# EAGLE schematic H17R10 (EAGLE 9.6.2)

## Sheet 1 of 4: backend (logics)
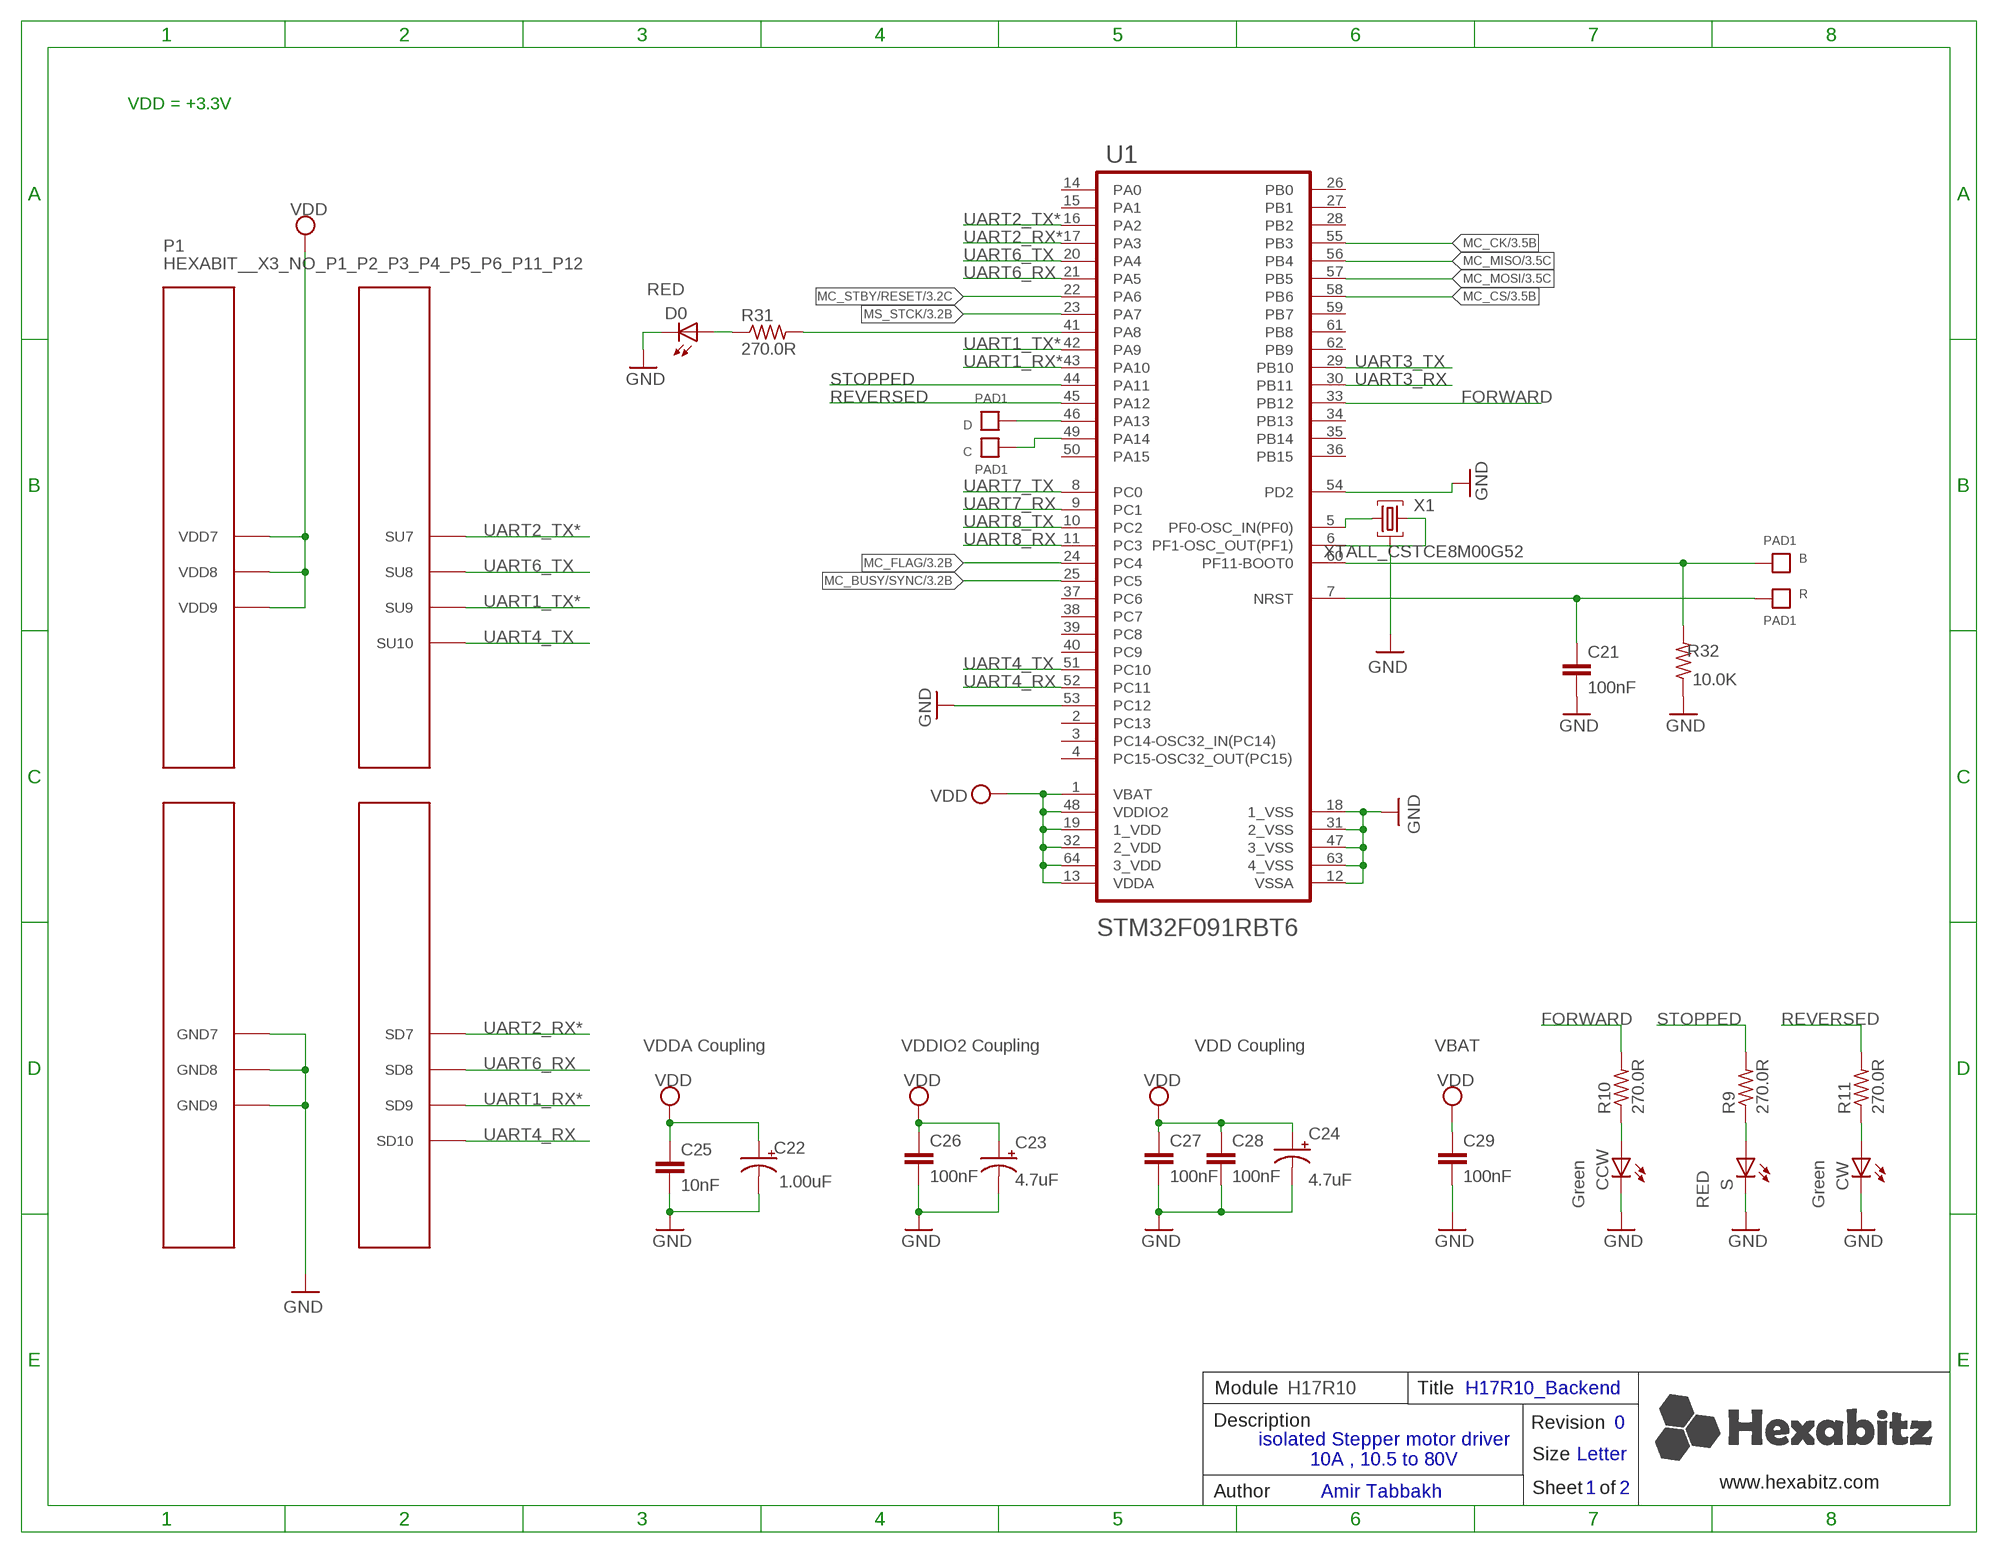
[diagram p0: schematic, sheet 1]

### Parts
B  PAD1  [PAD1]
C  PAD1  [PAD1]
C21  100nF  C-0603  [C-0603]
C22  1.00uF  C-0805-POL  [C-0805-POL]
C23  4.7uF  C-0805-POL  [C-0805-POL]
C24  4.7uF  C-0805-POL  [C-0805-POL]
C25  10nF  C-0603  [C-0603]
C26  100nF  C-0603  [C-0603]
C27  100nF  C-0603  [C-0603]
C28  100nF  C-0603  [C-0603]
C29  100nF  C-0603  [C-0603]
CCW  Green  VLMTG1300-GS08  [VLMTG1300-GS08]
CW  Green  VLMTG1300-GS08  [VLMTG1300-GS08]
D  PAD1  [PAD1]
D0  RED  VLMS1300-GS08  [VLMS1300-GS08]
P1  HEXABIT__X3_NO_P1_P2_P3_P4_P5_P6_P11_P12  [HEXABIT_17.32_X3_NO_P1_P2_P3_P4_P5_P6_P11_P12]
R  PAD1  [PAD1]
R9  270.0R  R-0603  [R-0603]
R10  270.0R  R-0603  [R-0603]
R11  270.0R  R-0603  [R-0603]
R31  270.0R  R-0603  [R-0603]
R32  10.0K  R-0603  [R-0603]
S  RED  VLMS1300-GS08  [VLMS1300-GS08]
U1  STM32F091RBT6STMICROELECTRONICS_STM32F091RBT6_0_1  [STMICROELECTRONICS_STM32F091RBT6_1]
X1  XTALL_CSTCE8M00G52  [XTALL_CSTCE8M00G52]

### Nets
B1: B.P$1 B.P$2 R32.2 U1.60(PF11-BOOT0)
FORWARD: R10.2 U1.33(PB12)
GND: C21.2 C22.2(-) C23.2(-) C24.2(-) C25.2 C26.2 C27.2 C28.2 C29.2 CCW.C CW.C D0.C P1.PAD_PD12(GND7) P1.PAD_PD17(GND8) P1.PAD_PD19(GND9) R32.1 S.C U1.12(VSSA) U1.18(1_VSS) U1.31(2_VSS) U1.47(3_VSS) U1.53(PC12) U1.54(PD2) U1.63(4_VSS) X1.P$2 ; also sheet 3,4
MC_BUSY/SYNC: U1.25(PC5) ; also sheet 3
MC_CK: U1.55(PB3) ; also sheet 3
MC_CS: U1.58(PB6) ; also sheet 3
MC_FLAG: U1.24(PC4) ; also sheet 3
MC_MISO: U1.56(PB4) ; also sheet 3
MC_MOSI: U1.57(PB5) ; also sheet 3
MC_STBY/RESET: U1.22(PA6) ; also sheet 3
MS_STCK: U1.23(PA7) ; also sheet 3
N$3: R31.2 U1.41(PA8)
N$4: D0.A R31.1
N$5: U1.5(PF0-OSC_IN(PF0)) X1.P$1
N$6: U1.6(PF1-OSC_OUT(PF1)) X1.P$3
N$7: D.P$1 D.P$2 U1.46(PA13)
N$9: C.P$1 C.P$2 U1.49(PA14)
N$11: R9.1 S.A
N$24: CCW.A R10.1
N$25: CW.A R11.1
R1: C21.1 R.P$1 R.P$2 U1.7(NRST)
REVERSED: R11.2 U1.45(PA12)
STOPPED: R9.2 U1.44(PA11)
UART1_RX*: P1.PAD_PD2(SD9) U1.43(PA10)
UART1_TX*: P1.PAD_PU2(SU9) U1.42(PA9)
UART2_RX*: P1.PAD_PD3(SD7) U1.17(PA3)
UART2_TX*: P1.PAD_PU3(SU7) U1.16(PA2)
UART3_RX: U1.30(PB11)
UART3_TX: U1.29(PB10)
UART4_RX: P1.PAD_PD8(SD10) U1.52(PC11)
UART4_TX: P1.PAD_PU8(SU10) U1.51(PC10)
UART6_RX: P1.PAD_PD1(SD8) U1.21(PA5)
UART6_TX: P1.PAD_PU1(SU8) U1.20(PA4)
UART7_RX: U1.9(PC1)
UART7_TX: U1.8(PC0)
UART8_RX: U1.11(PC3)
UART8_TX: U1.10(PC2)
VDD: C22.1(+) C23.1(+) C24.1(+) C25.1 C26.1 C27.1 C28.1 C29.1 P1.PAD_PU12(VDD7) P1.PAD_PU17(VDD8) P1.PAD_PU19(VDD9) U1.1(VBAT) U1.13(VDDA) U1.19(1_VDD) U1.32(2_VDD) U1.48(VDDIO2) U1.64(3_VDD) ; also sheet 3,4
Unconnected: U1.2(PC13) U1.3(PC14-OSC32_IN(PC14)) U1.4(PC15-OSC32_OUT(PC15)) U1.14(PA0) U1.15(PA1) U1.26(PB0) U1.27(PB1) U1.28(PB2) U1.34(PB13) U1.35(PB14) U1.36(PB15) U1.37(PC6) U1.38(PC7) U1.39(PC8) U1.40(PC9) U1.50(PA15) U1.59(PB7) U1.61(PB8) U1.62(PB9)

### Notes on the sheet
- VDD = +3.3V
- VDDA Coupling | VDDIO2 Coupling | VDD Coupling | VBAT
- Module | H17R10 | Title | H17R10_Backend
- Description | Revision | 0
- isolated Stepper motor driver 
  10A , 10.5 to 80V
- Size | Letter
- www.hexabitz.com
- Author | Amir Tabbakh | Sheet   of | 1 | 2
- C:/Users/Admin/Desktop/logodraft.bmp

## Sheet 2 of 4: High power
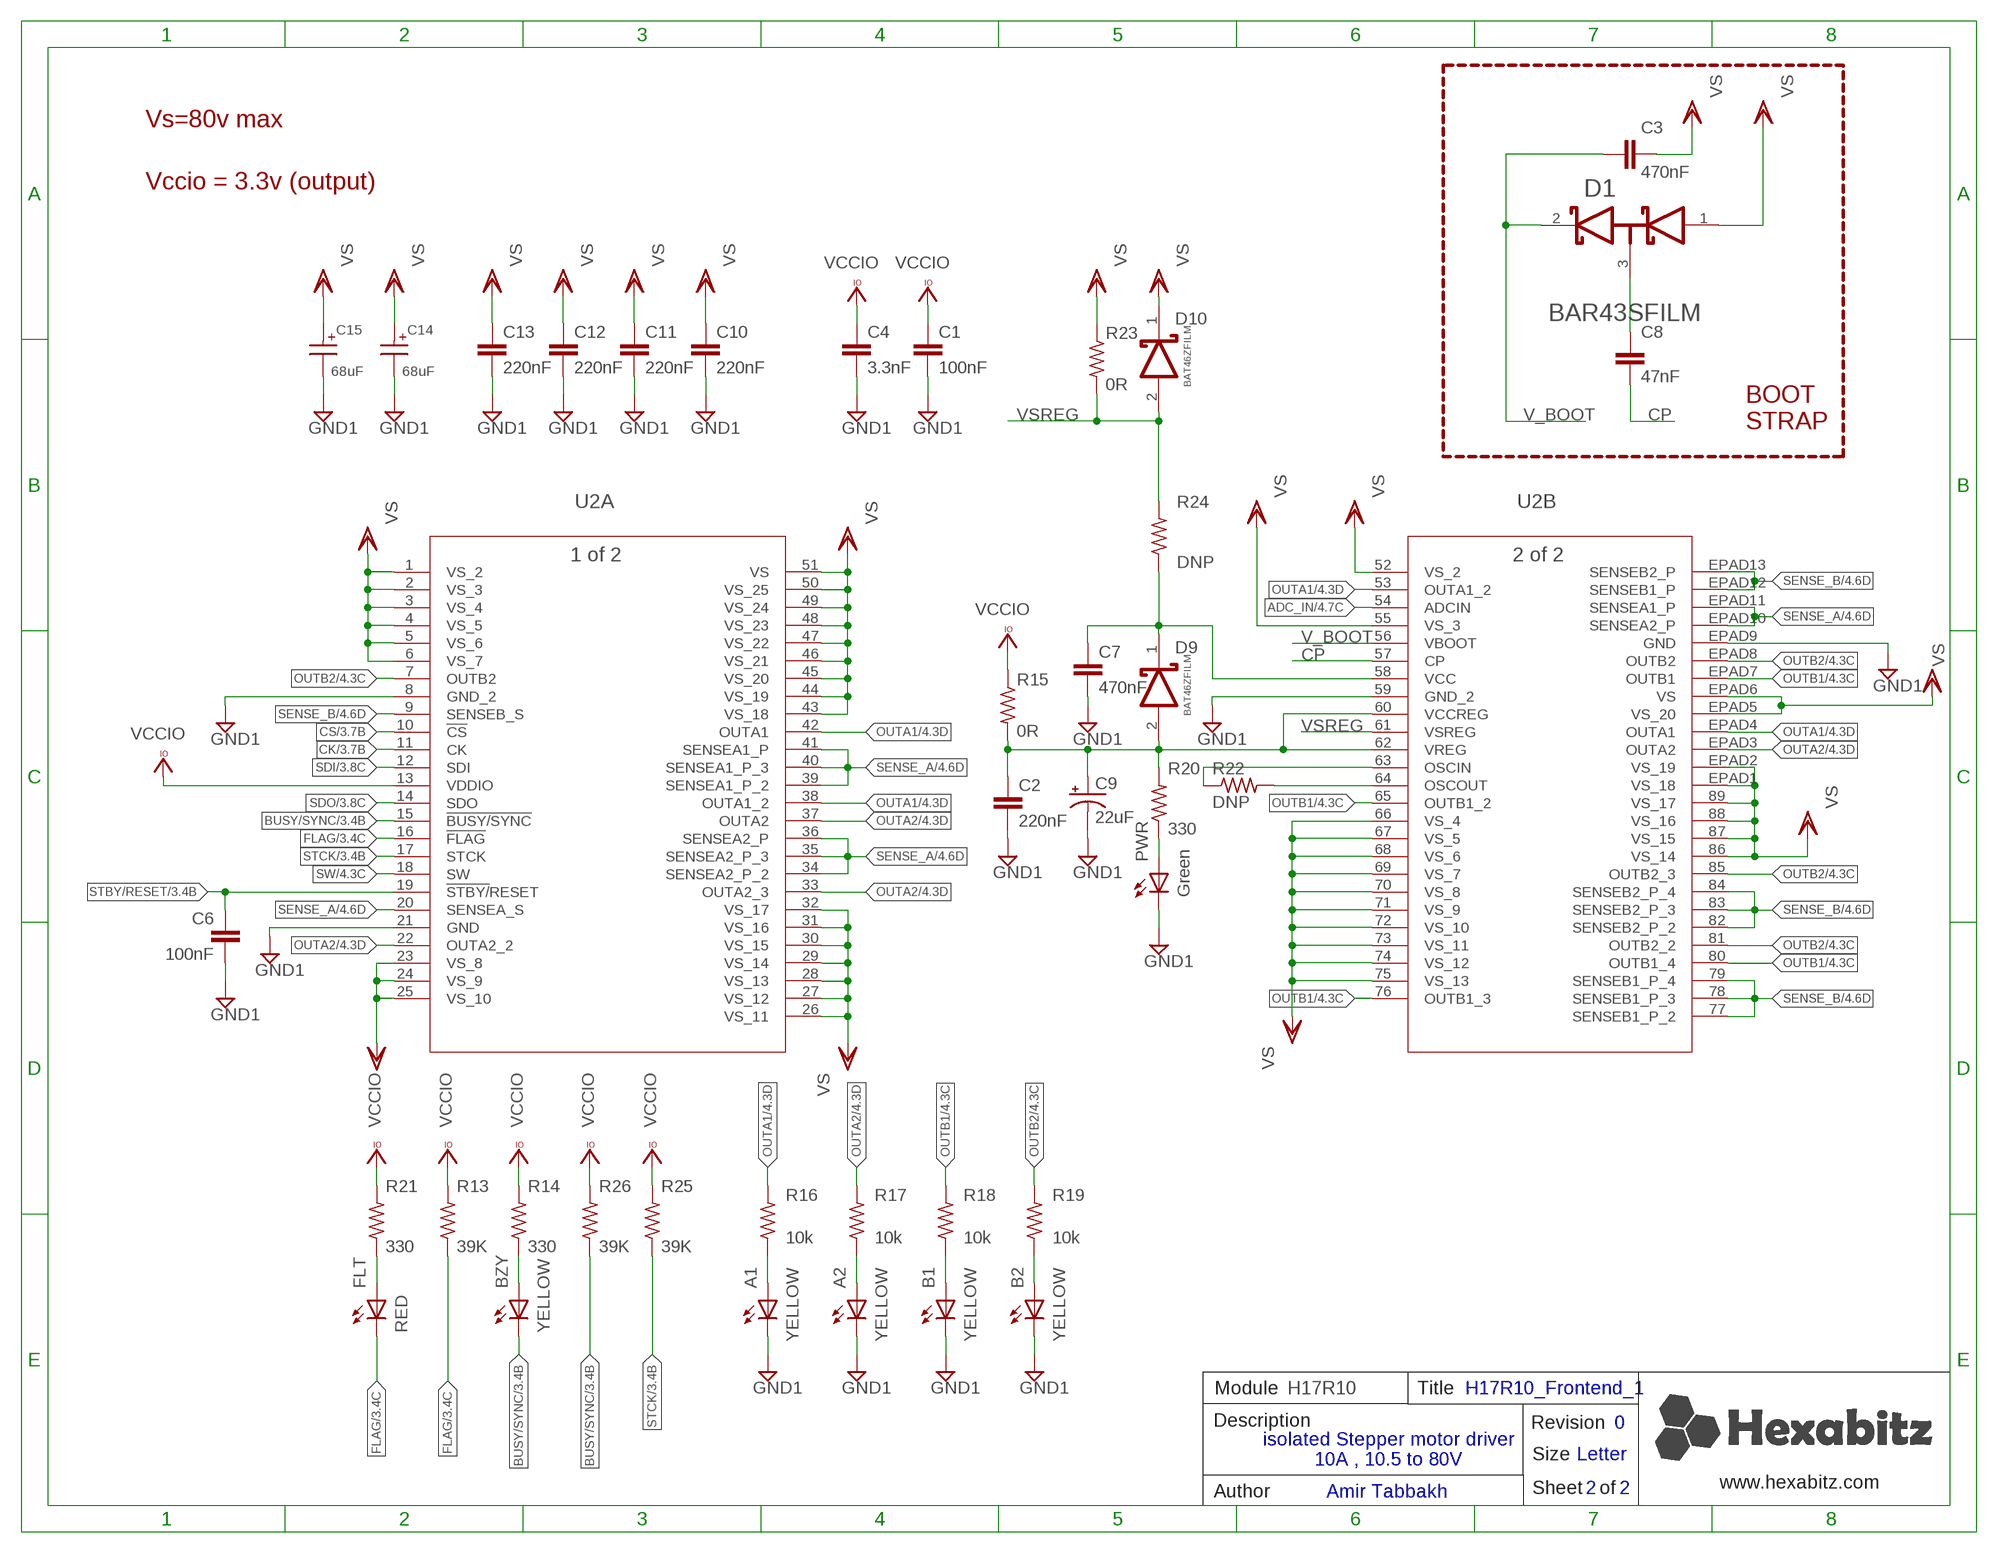
[diagram p1: schematic, sheet 2]

### Parts
A1  YELLOW  VLMY1300-GS08  [VLMY1300-GS08]
A2  YELLOW  VLMY1300-GS08  [VLMY1300-GS08]
B1  YELLOW  VLMY1300-GS08  [VLMY1300-GS08]
B2  YELLOW  VLMY1300-GS08  [VLMY1300-GS08]
BZY  YELLOW  VLMY1300-GS08  [VLMY1300-GS08]
C1  100nF  C-0603  [C-0603]
C2  220nF  C-0603  [C-0603]
C3  470nF  C-0603  [C-0603]
C4  3.3nF  C-0603  [C-0603]
C6  100nF  C-0603  [C-0603]
C7  470nF  C-0603  [C-0603]
C8  47nF  C-0805  [C-0805]
C9  22uF  C-0805-POL  [C-0805-POL]
C10  220nF  C-0805  [C-0805]
C11  220nF  C-0805  [C-0805]
C12  220nF  C-0805  [C-0805]
C13  220nF  C-0805  [C-0805]
C14  68uF  WCAP-ASLI_12.5X14EEVFK2A680Q  [WCAP-ASLI_12.5X14(DXL)]
C15  68uF  WCAP-ASLI_12.5X14EEVFK2A680Q  [WCAP-ASLI_12.5X14(DXL)]
D1  STMICROELECTRONICS_BAR43SFILMSTMICROELECTRONICS_BAR43SFILM_0_0  [STMICROELECTRONICS_BAR43SFILM_0]
D9  STMICROELECTRONICS_BAT46ZFILMSTMICROELECTRONICS_BAT46ZFILM_0_3  [STMICROELECTRONICS_BAT46ZFILM_3]
D10  STMICROELECTRONICS_BAT46ZFILMSTMICROELECTRONICS_BAT46ZFILM_0_3  [STMICROELECTRONICS_BAT46ZFILM_3]
FLT  RED  VLMS1300-GS08  [VLMS1300-GS08]
PWR  Green  VLMTG1300-GS08  [VLMTG1300-GS08]
R13  39K  R-0603  [R-0603]
R14  330  R-0603  [R-0603]
R15  0R  R-0603  [R-0603]
R16  10k  R-0805  [R-0805]
R17  10k  R-0805  [R-0805]
R18  10k  R-0805  [R-0805]
R19  10k  R-0805  [R-0805]
R20  330  R-0603  [R-0603]
R21  330  R-0603  [R-0603]
R22  DNP  R-0603  [R-0603]
R23  0R  R-0603  [R-0603]
R24  DNP  R-0805  [R-0805]
R25  39K  R-0603  [R-0603]
R26  39K  R-0603  [R-0603]
U2  POWERSTEP01  [VFQFPN89_11X14X1_STM]

### Nets
ADC_IN: U2.54(B:ADCIN) ; also sheet 4
BUSY/SYNC: BZY.C R26.1 U2.15(A:!BUSY/SYNC) ; also sheet 3
CK: U2.11(A:CK) ; also sheet 3
CP: C8.1 U2.57(B:CP)
CS: U2.10(A:!CS) ; also sheet 3
FLAG: FLT.C R13.1 U2.16(A:!FLAG) ; also sheet 3
GND1: A1.C A2.C B1.C B2.C C1.2 C2.2 C4.2 C6.2 C7.2 C9.2(-) C10.2 C11.2 C12.2 C13.2 C14.2(-) C15.2(-) PWR.C U2.8(A:GND_2) U2.21(A:GND) U2.59(B:GND_2) U2.EPAD9(B:GND) ; also sheet 3,4
N$1: C2.1 C9.1(+) D9.2(ANODE) R15.2 R20.2 U2.60(B:VCCREG) U2.62(B:VREG)
N$2: C8.2 D1.3(A1/K2)
N$8: C7.1 D9.1(CATHODE) R24.1 U2.58(B:VCC)
N$10: A1.A R16.1
N$12: BZY.A R14.1
N$13: FLT.A R21.1
N$14: PWR.A R20.1
N$15: A2.A R17.1
N$16: B1.A R18.1
N$17: B2.A R19.1
N$22: R22.2 U2.64(B:OSCOUT)
N$23: R22.1 U2.63(B:OSCIN)
OUTA1: R16.2 U2.38(A:OUTA1_2) U2.42(A:OUTA1) U2.53(B:OUTA1_2) U2.EPAD4(B:OUTA1) ; also sheet 4
OUTA2: R17.2 U2.22(A:OUTA2_2) U2.33(A:OUTA2_3) U2.37(A:OUTA2) U2.EPAD3(B:OUTA2) ; also sheet 4
OUTB1: R18.2 U2.65(B:OUTB1_2) U2.76(B:OUTB1_3) U2.80(B:OUTB1_4) U2.EPAD7(B:OUTB1) ; also sheet 4
OUTB2: R19.2 U2.7(A:OUTB2) U2.81(B:OUTB2_2) U2.85(B:OUTB2_3) U2.EPAD8(B:OUTB2) ; also sheet 4
SDI: U2.12(A:SDI) ; also sheet 3
SDO: U2.14(A:SDO) ; also sheet 3
SENSE_A: U2.20(A:SENSEA_S) U2.34(A:SENSEA2_P_2) U2.35(A:SENSEA2_P_3) U2.36(A:SENSEA2_P) U2.39(A:SENSEA1_P_2) U2.40(A:SENSEA1_P_3) U2.41(A:SENSEA1_P) U2.EPAD10(B:SENSEA2_P) U2.EPAD11(B:SENSEA1_P) ; also sheet 4
SENSE_B: U2.9(A:SENSEB_S) U2.77(B:SENSEB1_P_2) U2.78(B:SENSEB1_P_3) U2.79(B:SENSEB1_P_4) U2.82(B:SENSEB2_P_2) U2.83(B:SENSEB2_P_3) U2.84(B:SENSEB2_P_4) U2.EPAD12(B:SENSEB1_P) U2.EPAD13(B:SENSEB2_P) ; also sheet 4
STBY/RESET: C6.1 U2.19(A:!STBY/!RESET) ; also sheet 3
STCK: R25.1 U2.17(A:STCK) ; also sheet 3
SW: U2.18(A:SW) ; also sheet 4
V_BOOT: C3.1 D1.2(K1) U2.56(B:VBOOT)
VCCIO: C1.1 C4.1 R13.2 R14.2 R15.1 R21.2 R25.2 R26.2 U2.13(A:VDDIO) ; also sheet 3,4
VSREG: D10.2(ANODE) R23.2 R24.2 U2.61(B:VSREG)
VSS: C3.2 C10.1 C11.1 C12.1 C13.1 C14.1(+) C15.1(+) D1.1(A2) D10.1(CATHODE) R23.1 U2.1(A:VS_2) U2.2(A:VS_3) U2.3(A:VS_4) U2.4(A:VS_5) U2.5(A:VS_6) U2.6(A:VS_7) U2.23(A:VS_8) U2.24(A:VS_9) U2.25(A:VS_10) U2.26(A:VS_11) U2.27(A:VS_12) U2.28(A:VS_13) U2.29(A:VS_14) U2.30(A:VS_15) U2.31(A:VS_16) U2.32(A:VS_17) U2.43(A:VS_18) U2.44(A:VS_19) U2.45(A:VS_20) U2.46(A:VS_21) U2.47(A:VS_22) U2.48(A:VS_23) U2.49(A:VS_24) U2.50(A:VS_25) U2.51(A:VS) U2.52(B:VS_2) U2.55(B:VS_3) U2.66(B:VS_4) U2.67(B:VS_5) U2.68(B:VS_6) U2.69(B:VS_7) U2.70(B:VS_8) U2.71(B:VS_9) U2.72(B:VS_10) U2.73(B:VS_11) U2.74(B:VS_12) U2.75(B:VS_13) U2.86(B:VS_14) U2.87(B:VS_15) U2.88(B:VS_16) U2.89(B:VS_17) U2.EPAD1(B:VS_18) U2.EPAD2(B:VS_19) U2.EPAD5(B:VS_20) U2.EPAD6(B:VS) ; supply symbol labelled VS ; also sheet 4

### Notes on the sheet
- Vs=80v max
- Vccio = 3.3v (output)
- BOOT
  STRAP
- Module | H17R10 | Title | H17R10_Frontend_1
- Description | Revision | 0
- isolated Stepper motor driver 
  10A , 10.5 to 80V
- Size | Letter
- www.hexabitz.com
- Author | Amir Tabbakh | Sheet   of | 2 | 2

## Sheet 3 of 4: isolation parts
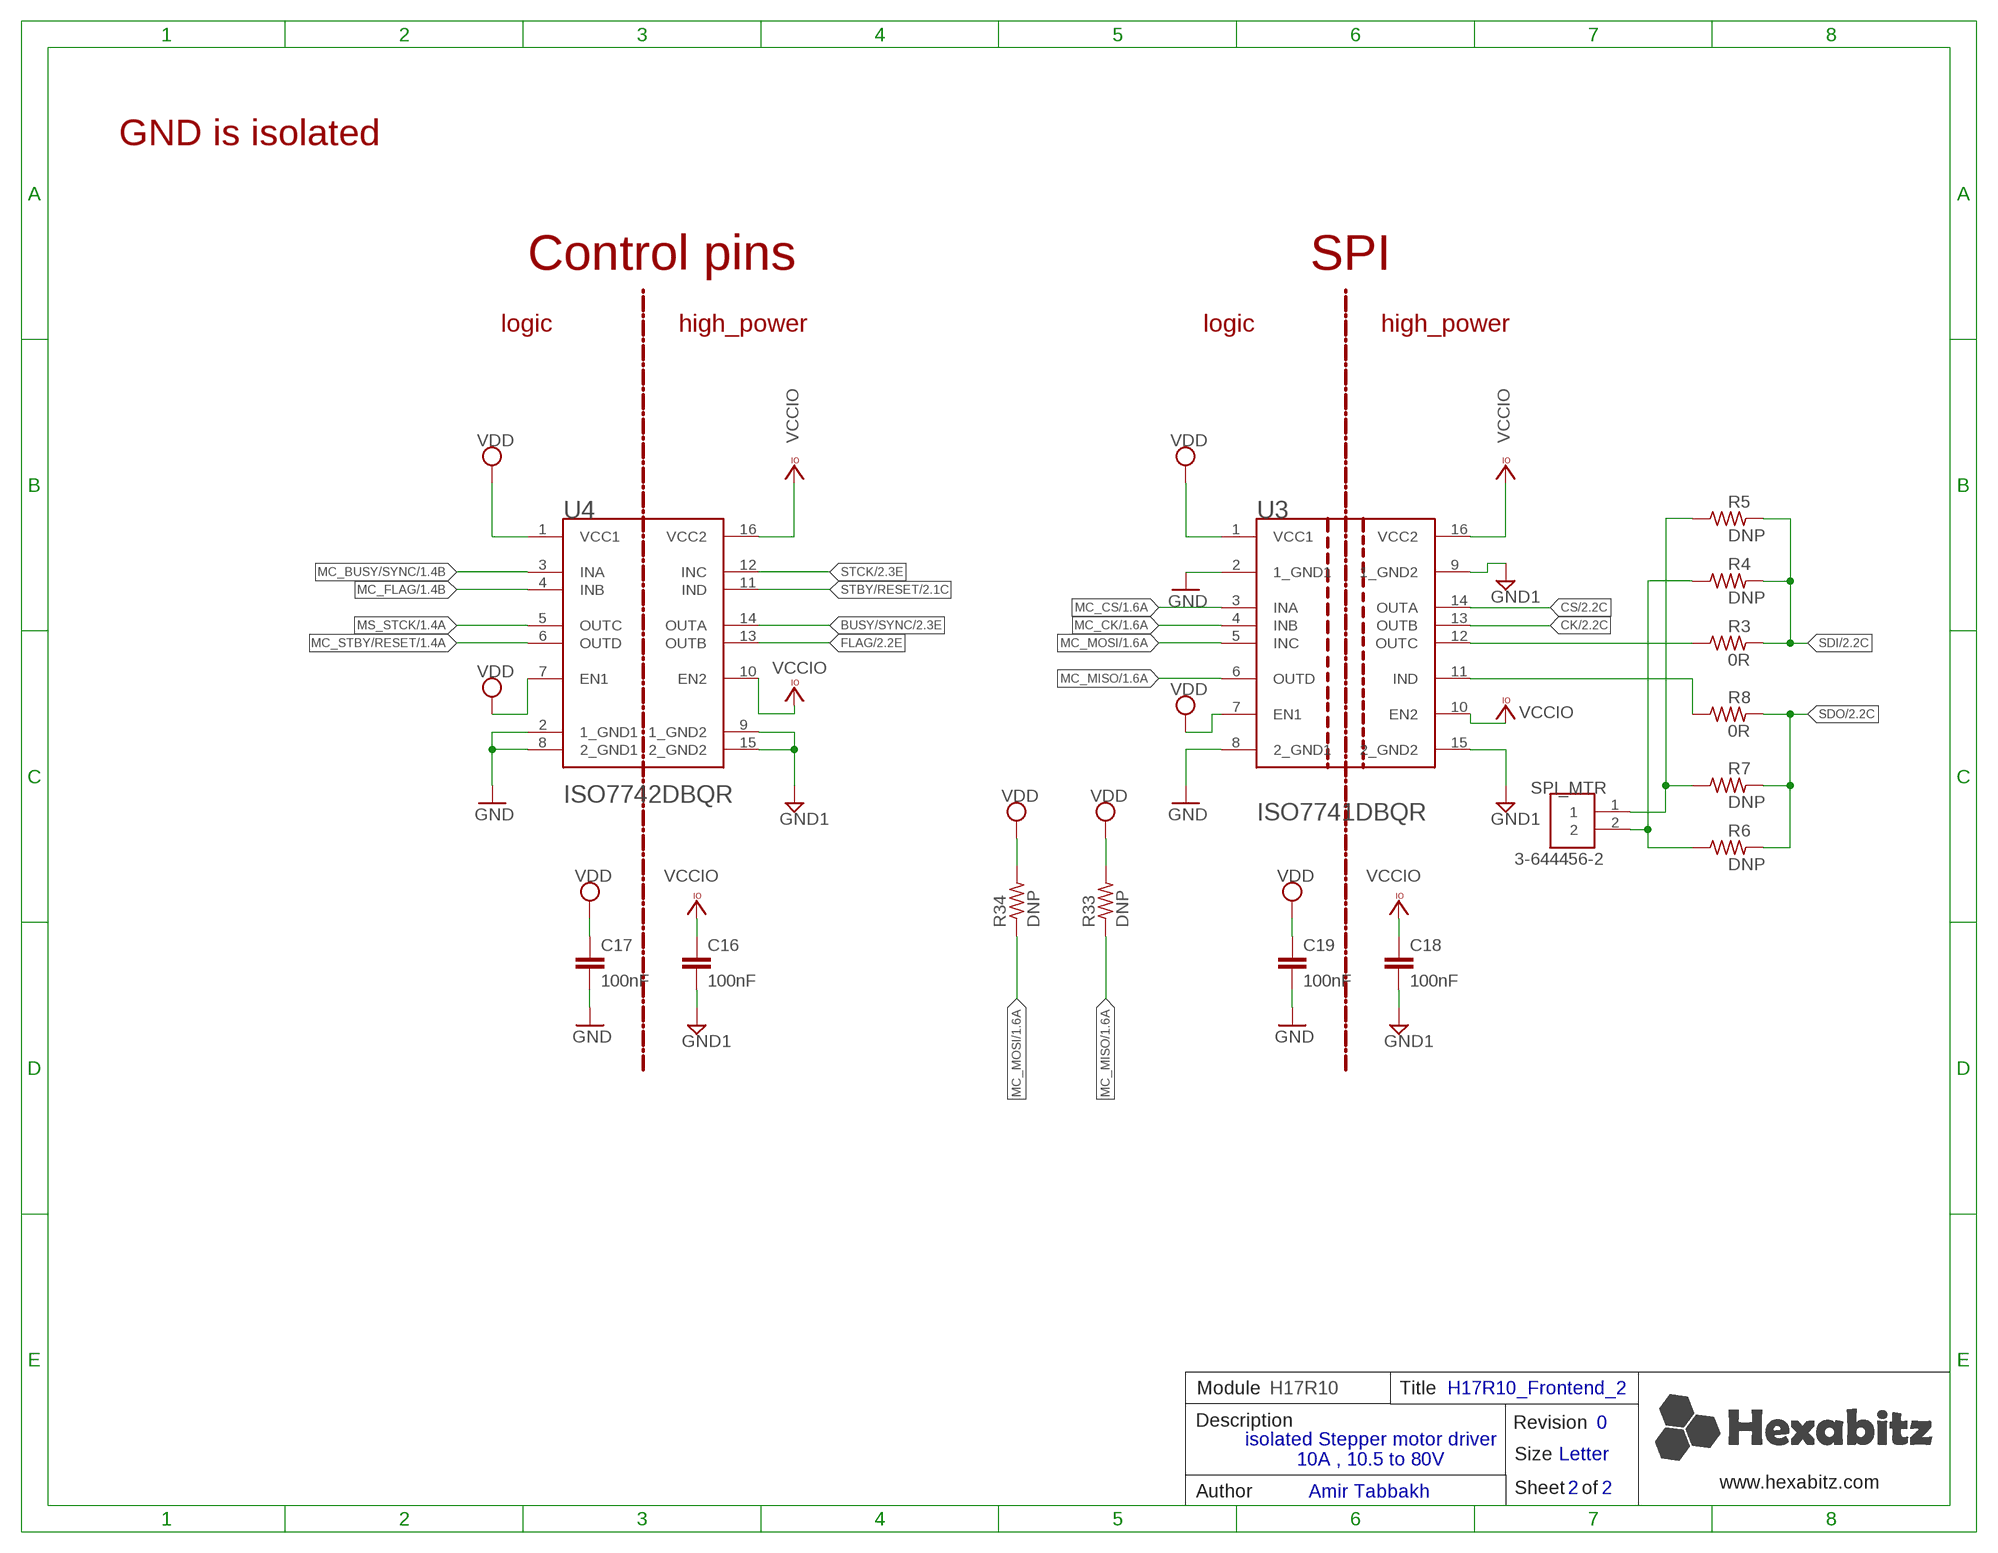
[diagram p2: schematic, sheet 3]

### Parts
C16  100nF  C-0603  [C-0603]
C17  100nF  C-0603  [C-0603]
C18  100nF  C-0603  [C-0603]
C19  100nF  C-0603  [C-0603]
R3  0R  R-0603  [R-0603]
R4  DNP  R-0603  [R-0603]
R5  DNP  R-0603  [R-0603]
R6  DNP  R-0603  [R-0603]
R7  DNP  R-0603  [R-0603]
R8  0R  R-0603  [R-0603]
R33  DNP  R-0603  [R-0603]
R34  DNP  R-0603  [R-0603]
SPI_MTR  3-644456-2  [TE_3-644456-2]
U3  TEXAS_INSTRUMENTS_ISO7741DBQRTEXAS_INSTRUMENTS_ISO7741DBQR_0_0  [TEXAS_INSTRUMENTS_ISO7741DBQR_0]
U4  TEXAS_INSTRUMENTS_ISO7742DBQRTEXAS_INSTRUMENTS_ISO7742DBQR_0_3  [TEXAS_INSTRUMENTS_ISO7742DBQR_3]

### Nets
BUSY/SYNC: U4.14(OUTA) ; also sheet 2
CK: U3.13(OUTB) ; also sheet 2
CS: U3.14(OUTA) ; also sheet 2
FLAG: U4.13(OUTB) ; also sheet 2
GND: C17.2 C19.2 U3.2(1_GND1) U3.8(2_GND1) U4.2(1_GND1) U4.8(2_GND1) ; also sheet 1,4
GND1: C16.2 C18.2 U3.9(1_GND2) U3.15(2_GND2) U4.9(1_GND2) U4.15(2_GND2) ; also sheet 2,4
MC_BUSY/SYNC: U4.3(INA) ; also sheet 1
MC_CK: U3.4(INB) ; also sheet 1
MC_CS: U3.3(INA) ; also sheet 1
MC_FLAG: U4.4(INB) ; also sheet 1
MC_MISO: R33.1 U3.6(OUTD) ; also sheet 1
MC_MOSI: R34.1 U3.5(INC) ; also sheet 1
MC_STBY/RESET: U4.6(OUTD) ; also sheet 1
MS_STCK: U4.5(OUTC) ; also sheet 1
N$18: R3.1 U3.12(OUTC)
N$19: R8.1 U3.11(IND)
N$20: R4.1 R6.1 SPI_MTR.2
N$21: R5.1 R7.1 SPI_MTR.1
SDI: R3.2 R4.2 R5.2 ; also sheet 2
SDO: R6.2 R7.2 R8.2 ; also sheet 2
STBY/RESET: U4.11(IND) ; also sheet 2
STCK: U4.12(INC) ; also sheet 2
VCCIO: C16.1 C18.1 U3.10(EN2) U3.16(VCC2) U4.10(EN2) U4.16(VCC2) ; also sheet 2,4
VDD: C17.1 C19.1 R33.2 R34.2 U3.1(VCC1) U3.7(EN1) U4.1(VCC1) U4.7(EN1) ; also sheet 1,4

### Notes on the sheet
- GND is isolated
- Control pins | SPI
- logic | high_power | logic | high_power
- Module | H17R10 | Title | H17R10_Frontend_2
- Description | Revision | 0
- isolated Stepper motor driver 
  10A , 10.5 to 80V
- Size | Letter
- www.hexabitz.com
- Author | Amir Tabbakh | Sheet   of | 2 | 2

## Sheet 4 of 4: I/O parts
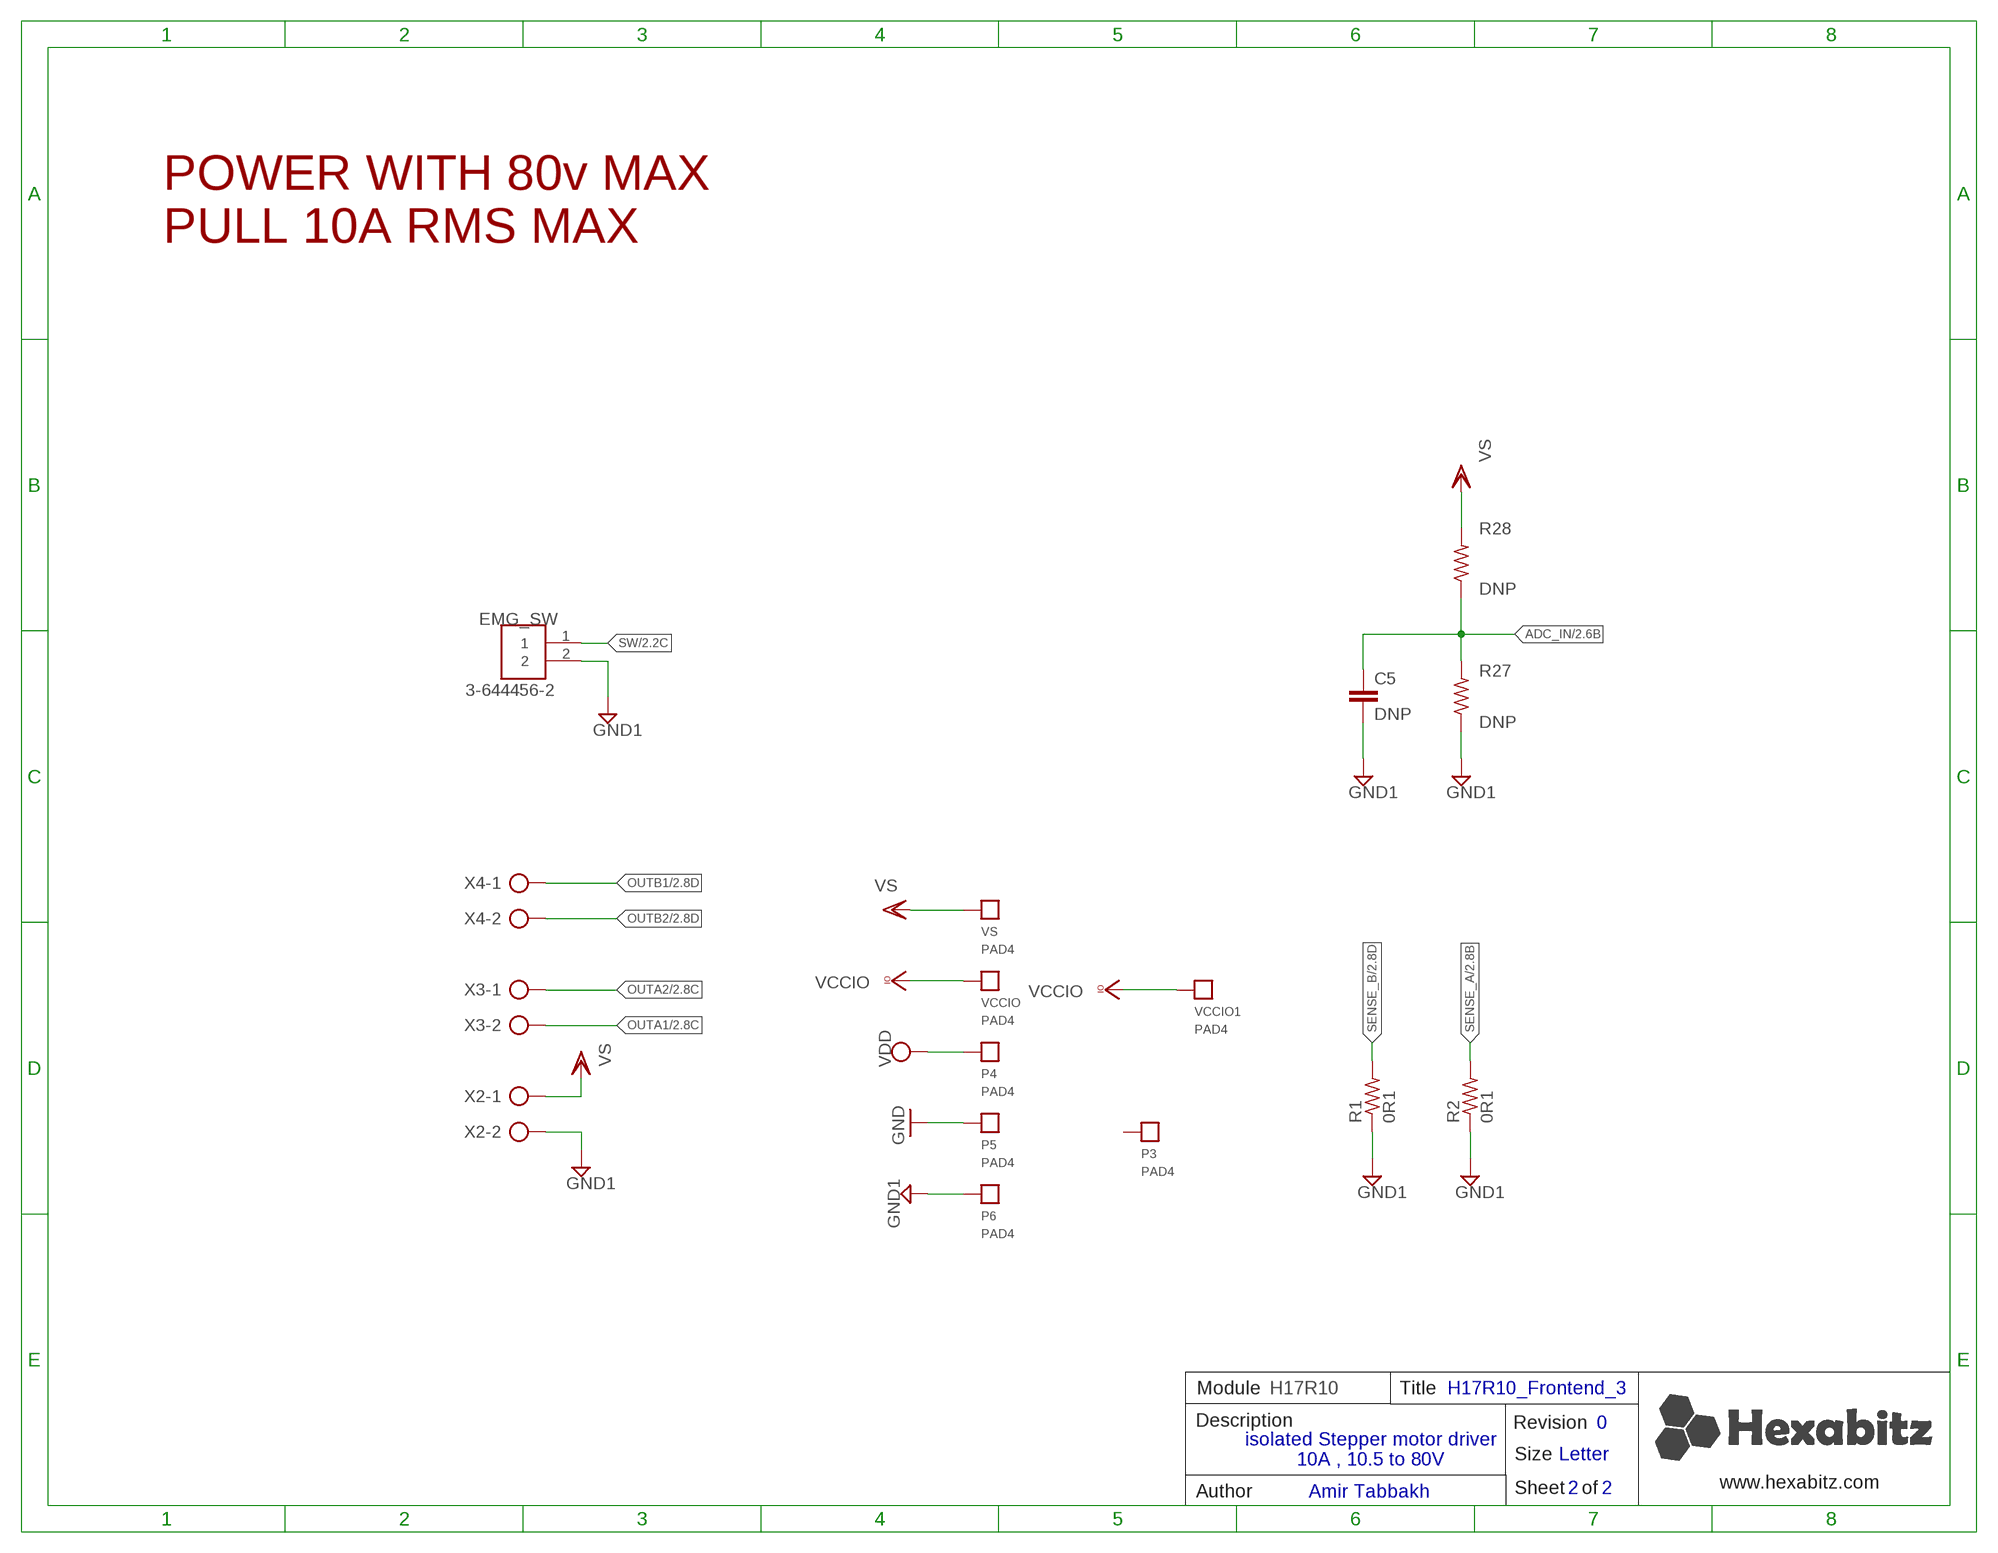
[diagram p3: schematic, sheet 4]

### Parts
C5  DNP  C-0603  [C-0603]
EMG_SW  3-644456-2  [TE_3-644456-2]
P3  PAD4  [PAD4]
P4  PAD4  [PAD4]
P5  PAD4  [PAD4]
P6  PAD4  [PAD4]
R1  0R1  R-US_R2512  [R2512]
R2  0R1  R-US_R2512  [R2512]
R27  DNP  R-0603  [R-0603]
R28  DNP  R-0805  [R-0805]
VCCIO  PAD4  [PAD4]
VCCIO1  PAD4  [PAD4]
VS  PAD4  [PAD4]
X2  AK500/2  [AK500/2]
X3  AK500/2  [AK500/2]
X4  AK500/2  [AK500/2]

### Nets
ADC_IN: C5.1 R27.2 R28.1 ; also sheet 2
GND: P5.P$1 ; also sheet 1,3
GND1: C5.2 EMG_SW.2 P6.P$1 R1.1 R2.1 R27.1 X2.2 ; also sheet 2,3
OUTA1: X3.2 ; also sheet 2
OUTA2: X3.1 ; also sheet 2
OUTB1: X4.1 ; also sheet 2
OUTB2: X4.2 ; also sheet 2
SENSE_A: R2.2 ; also sheet 2
SENSE_B: R1.2 ; also sheet 2
SW: EMG_SW.1 ; also sheet 2
VCCIO: VCCIO1.P$1 VCCIO.P$1 ; also sheet 2,3
VDD: P4.P$1 ; also sheet 1,3
VSS: R28.2 VS.P$1 X2.1 ; supply symbol labelled VS ; also sheet 2
Unconnected: P3.P$1

### Notes on the sheet
- POWER WITH 80v MAX
  PULL 10A RMS MAX
- Module | H17R10 | Title | H17R10_Frontend_3
- Description | Revision | 0
- isolated Stepper motor driver 
  10A , 10.5 to 80V
- Size | Letter
- www.hexabitz.com
- Author | Amir Tabbakh | Sheet   of | 2 | 2

## Library data of the parts
A1 A2 B1 B2 BZY = HEXABITZ_USER_INTERFACE_PARTS:VLMY1300-GS08: Yellow 0603 130° Clear 54 mcd 2 V Surface Mount ChipLED ; Octopart Url : http://octopart.com/vlmy1300-gs08-vishay-21709201; MFN: Lite-On; MPN: LTST-C170YKT; OCTOPART_URL: https://octopart.com/ltst-c170ykt-lite-on-549813?r=sp
B C D R = Hexabitz:PAD1
C1 C4 C6 C16-C19 = HEXABITZ_RCLS:C-0603: CAP CER 10% X7R 0603; CAPACITANCE: 100nF; MFN: TDK CORPORATION; MPN: C1608X7R1H104K080AA; OCTOPART_URL: https://octopart.com/c1608x7r1h104k080aa-tdk-25947665?r=sp
C2 = HEXABITZ_RCLS:C-0603: CAP CER 10% X7R 0603; MFN: TDK; MPN: CGA3E3X7R1V224K080AE; OCTOPART_URL: https://octopart.com/cga3e3x7r1v224k080ae-tdk-68305867?r=sp
C3 C7 = HEXABITZ_RCLS:C-0603: CAP CER 10% X7R 0603; MFN: TDK; MPN: CGA3E3X7R1E474K080AE; OCTOPART_URL: https://octopart.com/search?q=CAP+CER+470nF+25V+X7R+0603&currency=USD&specs=0
C5 = HEXABITZ_RCLS:C-0603: CAP CER 10% X7R 0603
C8 = HEXABITZ_RCLS:C-0805: CAP CER 10% X7R 0805; MFN: KEMET; MPN: C0805C473K1RACTU; OCTOPART_URL: https://octopart.com/c0805c473k1ractu-kemet-12557765?r=sp; VOLTAGE_RATING: 100V
C9 = HEXABITZ_RCLS:C-0805-POL: Cap Tant Solid SMD 2012; MFN: KEMET; MPN: T491A226K006AT; OCTOPART_URL: https://octopart.com/t491a226k006at-kemet-968601?r=sp; VOLTAGE_RATING: 6.3V
C10-C13 = HEXABITZ_RCLS:C-0805: CAP CER 10% X7R 0805
C14 C15 = HEXABITZ_RCLS:WCAP-ASLI_12.5X14: WCAP-ASLI Aluminium Electrolytic Capacitors Low Impedance +105 °C Characteristics Low impedance product series Mounting style: V-Chip SMT Capacitance range: 0.1 µF ‒ 6800 µF Capacitance tolerance: ±20 % Voltage range (UR): 6.3 ‒ 100 V(DC) Operating temperature: -55 °C up to +105 °C Endurance: 2000 h @ +105 °C Dimensions (DxL) in mm: 4.0 x 5.5 up to 16.0 x 17.0 Recommended soldering: Reflow soldering Applications Low impedance, especially for filtering applications Input and output capacitor for switched-mode power supply Filtering Smoothing e.g. DC/DC converter, AC/DC converter, satellite receiver, control panel <https://www.we-online.com/catalog/media/o14723v209%20Family_WCAP-ASLI.jpg> Details see: https://www.we-online.com/catalog/en/WCAP-ASLI/ Updated by yingchun,Shan;2020-03-03 2020(C) Würth Elektronik; MFN: Panasonic; MPN: EEVFK2A680Q; OCTOPART_URL: https://octopart.com/eevfk2a680q-panasonic-2421317?r=sp
C21 = HEXABITZ_RCLS:C-0603: CAP CER 10% X7R 0603; CAPACITANCE: 100nF; MFN: KEMET; MPN: C0603C104K8RACTU; OCTOPART_URL: https://octopart.com/c0603c104k8ractu-kemet-145075?r=sp&s=9bS9ASSwSEqMCE9KBEQZ0g; TOLERANCE: 10%; VOLTAGE_RATING: 10V
C22 = Hexabitz:C-0805-POL: Cap Tant Solid SMD 2012; CAPACITANCE: 1.00uF; MFN: Yageo; MPN: CC0805KKX7R7BB105; OCTOPART_URL: https://octopart.com/cc0805kkx7r7bb105-yageo-8376555?r=sp&s=YKl1wwtkROau_X5nniH2ig; TOLERANCE: 10%; VOLTAGE_RATING: 16V
C23 C24 = Hexabitz:C-0805-POL: Cap Tant Solid SMD 2012; CAPACITANCE: 4.7uF; MFN: Murata; MPN: GRM21BC81E475KA12L; OCTOPART_URL: https://octopart.com/grm21bc81e475ka12l-murata-10331911?r=sp&s=RY3qZSD8T6mG6TC9CHI5qQ; TOLERANCE: 10%; VOLTAGE_RATING: 25V
C25 = Hexabitz:C-0603: CAP CER 10% X7R 0603; CAPACITANCE: 10nF; MFN: KEMET; MPN: C0603C103K5RACTU; OCTOPART_URL: https://octopart.com/c0603c103k5ractu-kemet-133094?r=sp&s=R_iPBxLnSmGqhkU2rIMFpg; TOLERANCE: 10%; VOLTAGE_RATING: 50V
C26 C28 = Hexabitz:C-0603: CAP CER 10% X7R 0603; CAPACITANCE: 100nF; MFN: KEMET; MPN: C0603C104K8RACTU; OCTOPART_URL: https://octopart.com/c0603c104k8ractu-kemet-145075?r=sp&s=9bS9ASSwSEqMCE9KBEQZ0g; TOLERANCE: 10%; VOLTAGE_RATING: 10V
C27 = Hexabitz:C-0603: CAP CER 10% X7R 0603; CAPACITANCE: 100nF; MFN: KEMET; MPN: C0603C104K8RACTU; OCTOPART_URL: https://octopart.com/c0603c104k8ractu-kemet-145075?r=sp&s=9bS9ASSwSEqMCE9KBEQZ0g; TOLERANCE: 10%; VOLTAGE_RATING: 10
C29 = Hexabitz:C-0603: CAP CER 10% X7R 0603; CAPACITANCE: 100nF; MFN: KEMET; MPN: C0603C104K8RACTU; OCTOPART_URL: https://octopart.com/c0603c104k8ractu-kemet-145075?r=sp&s=9bS9ASSwSEqMCE9KBEQZ0g; TOLERANCE: 10V; VOLTAGE_RATING: 10%
CCW CW = HEXABITZ_USER_INTERFACE_PARTS:VLMTG1300-GS08: LED Uni-Color Green 530nm 2-Pin Chip 0603(1608Metric) T/R; MFN: Vishay; MPN: VLMS1300-GS08; OCTOPART_URL: https://octopart.com/vlms1300-gs08-vishay-21709201?r=sp&s=_gcP4_q8T1SC6PJQPTQ9yA
D0 S = HEXABITZ_USER_INTERFACE_PARTS:VLMS1300-GS08: Red 0603 130° Clear 54 mcd 2 V Surface Mount ChipLED ; Octopart Url : http://octopart.com/vlms1300-gs08-vishay-21709201; MFN: Vishay; MPN: VLMS1300-GS08; OCTOPART_URL: https://octopart.com/vlms1300-gs08-vishay-21709201?r=sp&s=_gcP4_q8T1SC6PJQPTQ9yA
D1 = HEXABITZ_RCLS:STMICROELECTRONICS_BAR43SFILM: DIODE ARRAY SCHOTTKY 30V SOT23-3; MFN: STMicroelectronics; MPN: BAR43SFILM; OCTOPART_URL: https://octopart.com/bar43sfilm-stmicroelectronics-39549077?r=sp
D9 D10 = HEXABITZ_RCLS:STMICROELECTRONICS_BAT46ZFILM: DIODE SCHOTTKY 100V 150MA SOD123; DESCRIPTION: Small Signal Diode, 100 V, 150 Ma, 1 V, 1 A Rohs Compliant: Yes; MFN: STMicroelectronics; MPN: BAT46ZFILM; OCTOPART_URL: https://octopart.com/bat46zfilm-stmicroelectronics-658190?r=sp
EMG_SW SPI_MTR = HEXABITZ_USER_INTERFACE_PARTS:3-644456-2; AVAILABILITY: Unavailable; CENTERLINE_PITCH: 2.54 mm[.1 in]; COMMENT: 3-644456-2; DESCRIPTION: Connector Unshrouded Header HDR 2 Position 2.54mm Solder Straight Thru-Hole; EU_ROHS_COMPLIANCE: Compliant; MF: TE Connectivity; MP: 3-644456-2; NUMBER_OF_POSITIONS: 2; PACKAGE: None; PRICE: None; PRODUCT_TYPE: Connector; TE_PURCHASE_URL: https://www.te.com/usa-en/product-3-644456-2.html?te_bu=Cor&te_type=disp&te_campaign=seda_glo_cor-seda-global-disp-prtnr-fy19-seda-model-bom-cta_sma-317_1&elqCampaignId=32493
FLT = HEXABITZ_USER_INTERFACE_PARTS:VLMS1300-GS08: Red 0603 130° Clear 54 mcd 2 V Surface Mount ChipLED ; Octopart Url : http://octopart.com/vlms1300-gs08-vishay-21709201; MFN: Lite-On; MPN: LTST-C170-EKT; OCTOPART_URL: https://octopart.com/ltst-c170ekt-lite-on-549816?r=sp
P1 = hexabitz_connectors:HEXABIT_?_X3_NO_P1_P2_P3_P4_P5_P6_P11_P12: Hexabitz Double Hexagon Module Connector Hexagon side length = 17.32mm. The following ports are removed: P5, P10, P11, P12
P3-P6 VCCIO VCCIO1 VS = HEXABITZ_CONNECTION_PARTS:PAD4
PWR = HEXABITZ_USER_INTERFACE_PARTS:VLMTG1300-GS08: LED Uni-Color Green 530nm 2-Pin Chip 0603(1608Metric) T/R; MFN: Lite-On; MPN: LTST-C170GKT; OCTOPART_URL: https://octopart.com/ltst-c170gkt-lite-on-549817?r=sp
R1 R2 = HEXABITZ_RCLS:R-US_: RESISTOR, American symbol; MFN: Yageo; MPN: PE2512FKE7W0R1L; OCTOPART_URL: https://octopart.com/pe2512fke7w0r1l-yageo-71384148?r=sp; SPICEPREFIX: R
R3 R8 R23 = HEXABITZ_RCLS:R-0603: Thick Film Resistors - SMD 0603; DESCRIPTION: RC Series 0603 0.1 W 0 Ohm Jumper Surface Mount Thick Film Chip Resistor; MFN: Yageo; MPN: RC0603JR-070RL; OCTOPART_URL: https://octopart.com/rc0603jr-070rl-yageo-1241539?r=sp
R4-R7 R22 = HEXABITZ_RCLS:R-0603: Thick Film Resistors - SMD 0603; MPN: DNP
R9-R11 R31 = HEXABITZ_RCLS:R-0603: Thick Film Resistors - SMD 0603; MFN: Yageo; MPN: RC0603FR-07270RL; OCTOPART_URL: https://octopart.com/search?q=RC0603FR-07270RL&start=0; RESISTANCE: 270.0 Ohm; TOLERANCE: 1%
R13 R25 R26 = HEXABITZ_RCLS:R-0603: Thick Film Resistors - SMD 0603; MFN: Yageo; MPN: RC0603FR-0739KL; OCTOPART_URL: https://octopart.com/rc0603fr-0739kl-yageo-55402883?r=sp; RESISTANCE: 39K
R14 R20 R21 = HEXABITZ_RCLS:R-0603: Thick Film Resistors - SMD 0603; MFN: Yageo; MPN: RC0603JR-07330RL; OCTOPART_URL: https://octopart.com/rc0603jr-07330rl-yageo-39803615?r=sp; RESISTANCE: 330
R15 = HEXABITZ_RCLS:R-0603: Thick Film Resistors - SMD 0603; MFN: Yageo; MPN: RC0603JR-070RL; OCTOPART_URL: https://octopart.com/rc0603jr-070rl-yageo-1241539?r=sp
R16-R19 = HEXABITZ_RCLS:R-0805: Thick Film Resistors - SMD 0605; MFN: Panasonic; MPN: ERJ-6GEYJ103V; OCTOPART_URL: https://octopart.com/erj-6geyj103v-panasonic-55422885?r=sp
R24 R28 = HEXABITZ_RCLS:R-0805: Thick Film Resistors - SMD 0605
R27 R33 R34 = HEXABITZ_RCLS:R-0603: Thick Film Resistors - SMD 0603
R32 = Hexabitz:R-0603: Thick Film Resistors - SMD 0603; MFN: Yageo; MPN: RC0603JR-0710KL; OCTOPART_URL: https://octopart.com/search?q=RC0603JR-0710KL&start=0; RESISTANCE: 10.0K Ohm; TOLERANCE: 5%
U1 = Hexabitz:STM32F091RBT6: MCU 32-bit ARM Cortex M0 RISC 128KB Flash 2.5V/3.3V 64-Pin LQFP Frame; CIIVA_IDS: 20240711; COMPONENT_LINK_1_DESCRIPTION: Manufacturer URL; COMPONENT_LINK_1_URL: http://www.st.com/; CORE: ARM Cortex-M0; DATASHEET: http://www.st.com/st-web-ui/static/active/en/resource/technical/document/datasheet/DM00115237.pdf; DATASHEET_VERSION: Rev. 2; DA_CONVERTER: 1; FLASH_SIZE_PROG_KB: 128; FOOTPRINT_VARIANT_NAME_0: Level C; FOOTPRINT_VARIANT_NAME_1: Level B; FOOTPRINT_VARIANT_NAME_2: Level A; IMPORTED: yes; IMPORTED_FROM: vault; IMPORT_TS: 1521852803; INTERNAL_RAM_SIZE_KB: 32; IOS_HIGH_CURRENT: 52; MF: STMicroelectronics; MFN: STMicroelectronics; MOUNTING_TECHNOLOGY: Surface Mount; MPN: STM32F091RBT6; OCTOPART_URL: https://octopart.com/stm32f091rbt6-stmicroelectronics-51988681?r=sp&s=nshh1g3RRwuzez1YsQrt1w; OPERATING_FREQUENCYF_PROCESSOR_SPEED_MHZ: 48; PACKAGE_DESCRIPTION: 64-Pin Low-profile Quad Flat Package, Body 10 x 10 mm, Pitch 0.5 mm; PACKAGE_REFERENCE: LQFP64; PACKING: Tray; PREFIX: U; RELEASE_DATE: 1490161467; SUPPLY_VOLTAGEVCC_MIN_V: 2; VAULT_GUID: 95B06E5F-7F06-470A-8EBC-FD74529BF319; VAULT_REVISION: C6B60D25-65BF-47EB-8D85-05054791449B
U2 = HEXABITZ_ICs:POWERSTEP01; BUILT_BY: EMA_Cory; COPYRIGHT: Copyright (C) 2018 Accelerated Designs. All rights reserved; DATASHEET: https://www.st.com/resource/en/datasheet/powerstep01.pdf; MANUFACTURER_PART_NUMBER: POWERSTEP01; SOURCELIBRARY: Add_to_database_2020-12-10; VENDOR: STMicroelectronics
U3 = HEXABITZ_ICs:TEXAS_INSTRUMENTS_ISO7741DBQR: General Purpose Digital Isolator 3000Vrms 4 Channel 100Mbps 85kV/µs CMTI 16-SSOP (0.154", 3.90mm Width); DESCRIPTION: Robust EMC, quad-channel, 3/1, reinforced digital isolator 16-SSOP -55 to 125; MFN: Texas Instruments; MPN: ISO7741DBQR; OCTOPART_URL: https://octopart.com/iso7741dbqr-texas+instruments-82338409?r=sp
U4 = Texas Instruments - ISO7742DBQR:TEXAS_INSTRUMENTS_ISO7742DBQR: MYNA BASED ISOLATOR; AMBIENT_TEMPERATURE_RANGE_HIGH: +125°C; AMBIENT_TEMPERATURE_RANGE_LOW: -55°C; AUTOMOTIVE: No; CENTROID_NOT_SPECIFIED: No; DATASHEET: http://www.ti.com/lit/ds/symlink/iso7742.pdf; DEVICE_CLASS_L1: Integrated Circuits (ICs); DEVICE_CLASS_L2: Interface ICs; DEVICE_CLASS_L3: unset; DIGIKEY_DESCRIPTION: IC MYNA BASED ISOLATOR; DIGIKEY_PART_NUMBER: 296-49658-1-ND; FOOTPRINT_PARAMETERS_1: {"fp_type":"SSOP","params":{"N":{"nom":16,"long name":"Number of leads","min":null,"max":null,"short name":"N","type":"count"},"A":{"nom":false,"long name":"Height","min":false,"max":1750000,"short name":"A","type":"measurement"},"A1":{"nom":false,"long name":"Package clearance","min":110000,"max":250000,"short name":"A1","type":"measurement"},"A2":{"nom":false,"long name":"Package height","min":false,"max":1640000,"short name":"A2","type":"measurement"},"E":{"nom":false,"long name":"Width /w leads","min":5800000,"max":6190000,"short name":"E","type":"measurement"},"E1":{"nom":false,"long name":"Package width","min":3810000,"max":3980000,"short name":"E1","type":"measurement"},"D":{"nom":false,"long name":"Package length","min":4810000,"max":5000000,"short name":"D","type":"measurement"},"B":{"nom":false,"long name":"Lead width","min":210000,"max":300000,"short name":"B","type":"measurement"},"C":{"nom":false,"long name":"Lead thickness","min":130000,"max":250000,"short name":"C","type":"measurement"},"L":{"nom":false,"long name":"Lead foot length","min":410000,"max":880000,"short name":"L","type":"measurement"},"e":{"nom":635000,"long name":"Lead pitch","min":null,"max":null,"short name":"e","type":"measurement"},"PHI":{"nom":false,"long name":"Lead angle","min":0,"max":8,"short name":"PHI","type":"measurement"},"HT":{"default":"No","long name":"Thermal pad","type":"multichoiceparent","short name":"HT","children":[]},"offset x":{"nom":0,"long name":"X Center offset","min":null,"max":null,"short name":"offset x","type":"measurement"},"offset y":{"nom":0,"long name":"Y Center offset","min":null,"max":null,"short name":"offset y","type":"measurement"},"LS":{"default":"Rounded rectangle","long name":"Land shape","type":"multichoice","short name":"LS"},"LS1":{"default":"Rectangle","long name":"Land shape (Pin 1)","type":"multichoice","short name":"LS1"},"solder toe":{"nom":550000,"long name":"Solder fillet (toe)","min":null,"max":null,"short name":"solder toe","type":"fixedmeasurement"},"solder heel":{"nom":450000,"long name":"Solder fillet (heel)","min":null,"max":null,"short name":"solder heel","type":"fixedmeasurement"},"solder side":{"nom":50000,"long name":"Solder fillet (side)","min":null,"max":null,"short name":"solder side","type":"fixedmeasurement"},"courtyard":{"nom":500000,"long name":"Courtyard","min":null,"max":null,"short name":"courtyard","type":"fixedmeasurement"},"SF":{"default":"A (> 0.625mm pitch)","long name":"Packing level","type":"multichoiceparent","short name":"SF","help":"http://support.upverter.com/customer/portal/articles/978783-what-is-a-footprint-packing-level","children":["solder toe","solder heel","solder side","courtyard"]}}}; FOOTPRINT_PARAMETERS_2: {"fp_type":"SSOP","params":{"N":{"nom":16,"long name":"Number of leads","min":null,"max":null,"short name":"N","type":"count"},"A":{"nom":false,"long name":"Height","min":false,"max":1750000,"short name":"A","type":"measurement"},"A1":{"nom":false,"long name":"Package clearance","min":110000,"max":250000,"short name":"A1","type":"measurement"},"A2":{"nom":false,"long name":"Package height","min":false,"max":1640000,"short name":"A2","type":"measurement"},"E":{"nom":false,"long name":"Width /w leads","min":5800000,"max":6190000,"short name":"E","type":"measurement"},"E1":{"nom":false,"long name":"Package width","min":3810000,"max":3980000,"short name":"E1","type":"measurement"},"D":{"nom":false,"long name":"Package length","min":4810000,"max":5000000,"short name":"D","type":"measurement"},"B":{"nom":false,"long name":"Lead width","min":210000,"max":300000,"short name":"B","type":"measurement"},"C":{"nom":false,"long name":"Lead thickness","min":130000,"max":250000,"short name":"C","type":"measurement"},"L":{"nom":false,"long name":"Lead foot length","min":410000,"max":880000,"short name":"L","type":"measurement"},"e":{"nom":635000,"long name":"Lead pitch","min":null,"max":null,"short name":"e","type":"measurement"},"PHI":{"nom":false,"long name":"Lead angle","min":0,"max":8,"short name":"PHI","type":"measurement"},"HT":{"default":"No","long name":"Thermal pad","type":"multichoiceparent","short name":"HT","children":[]},"offset x":{"nom":0,"long name":"X Center offset","min":null,"max":null,"short name":"offset x","type":"measurement"},"offset y":{"nom":0,"long name":"Y Center offset","min":null,"max":null,"short name":"offset y","type":"measurement"},"LS":{"default":"Rounded rectangle","long name":"Land shape","type":"multichoice","short name":"LS"},"LS1":{"default":"Rectangle","long name":"Land shape (Pin 1)","type":"multichoice","short name":"LS1"},"solder toe":{"nom":350000,"long name":"Solder fillet (toe)","min":null,"max":null,"short name":"solder toe","type":"fixedmeasurement"},"solder heel":{"nom":350000,"long name":"Solder fillet (heel)","min":null,"max":null,"short name":"solder heel","type":"fixedmeasurement"},"solder side":{"nom":30000,"long name":"Solder fillet (side)","min":null,"max":null,"short name":"solder side","type":"fixedmeasurement"},"courtyard":{"nom":250000,"long name":"Courtyard","min":null,"max":null,"short name":"courtyard","type":"fixedmeasurement"},"SF":{"default":"B (> 0.625mm pitch)","long name":"Packing level","type":"multichoiceparent","short name":"SF","help":"http://support.upverter.com/customer/portal/articles/978783-what-is-a-footprint-packing-level","children":["solder toe","solder heel","solder side","courtyard"]}}}; FOOTPRINT_PARAMETERS_3: {"fp_type":"SSOP","params":{"N":{"nom":16,"long name":"Number of leads","min":null,"max":null,"short name":"N","type":"count"},"A":{"nom":false,"long name":"Height","min":false,"max":1750000,"short name":"A","type":"measurement"},"A1":{"nom":false,"long name":"Package clearance","min":110000,"max":250000,"short name":"A1","type":"measurement"},"A2":{"nom":false,"long name":"Package height","min":false,"max":1640000,"short name":"A2","type":"measurement"},"E":{"nom":false,"long name":"Width /w leads","min":5800000,"max":6190000,"short name":"E","type":"measurement"},"E1":{"nom":false,"long name":"Package width","min":3810000,"max":3980000,"short name":"E1","type":"measurement"},"D":{"nom":false,"long name":"Package length","min":4810000,"max":5000000,"short name":"D","type":"measurement"},"B":{"nom":false,"long name":"Lead width","min":210000,"max":300000,"short name":"B","type":"measurement"},"C":{"nom":false,"long name":"Lead thickness","min":130000,"max":250000,"short name":"C","type":"measurement"},"L":{"nom":false,"long name":"Lead foot length","min":410000,"max":880000,"short name":"L","type":"measurement"},"e":{"nom":635000,"long name":"Lead pitch","min":null,"max":null,"short name":"e","type":"measurement"},"PHI":{"nom":false,"long name":"Lead angle","min":0,"max":8,"short name":"PHI","type":"measurement"},"HT":{"default":"No","long name":"Thermal pad","type":"multichoiceparent","short name":"HT","children":[]},"offset x":{"nom":0,"long name":"X Center offset","min":null,"max":null,"short name":"offset x","type":"measurement"},"offset y":{"nom":0,"long name":"Y Center offset","min":null,"max":null,"short name":"offset y","type":"measurement"},"LS":{"default":"Rounded rectangle","long name":"Land shape","type":"multichoice","short name":"LS"},"LS1":{"default":"Rectangle","long name":"Land shape (Pin 1)","type":"multichoice","short name":"LS1"},"solder toe":{"nom":150000,"long name":"Solder fillet (toe)","min":null,"max":null,"short name":"solder toe","type":"fixedmeasurement"},"solder heel":{"nom":250000,"long name":"Solder fillet (heel)","min":null,"max":null,"short name":"solder heel","type":"fixedmeasurement"},"solder side":{"nom":10000,"long name":"Solder fillet (side)","min":null,"max":null,"short name":"solder side","type":"fixedmeasurement"},"courtyard":{"nom":100000,"long name":"Courtyard","min":null,"max":null,"short name":"courtyard","type":"fixedmeasurement"},"SF":{"default":"C (> 0.625mm pitch)","long name":"Packing level","type":"multichoiceparent","short name":"SF","help":"http://support.upverter.com/customer/portal/articles/978783-what-is-a-footprint-packing-level","children":["solder toe","solder heel","solder side","courtyard"]}}}; FOOTPRINT_VARIANT_NAME_0: Recommended_Land_Pattern; FOOTPRINT_VARIANT_NAME_1: IPC_A; FOOTPRINT_VARIANT_NAME_2: IPC_B; FOOTPRINT_VARIANT_NAME_3: IPC_C; HEIGHT: 1.75mm; IPC_LAND_PATTERN_NAME: SOP64P600X175-16; LEAD_FREE: Yes; MAX_JUNCTION_TEMP: +150°C; MAX_SUPPLY_VOLTAGE: 5.5V; MF: Texas Instruments; MFG_PACKAGE_IDENT: DBQ0016A; MFG_PACKAGE_IDENT_DATE: 0; MFG_PACKAGE_IDENT_REV: 0; MIN_SUPPLY_VOLTAGE: 2.25V; MOUSER_DESCRIPTION: High-Speed, Low-Power, Robust EMC Quad-Channel Digital Isolator 16-SSOP -55 to 125; MOUSER_PART_NUMBER: 595-ISO7742DBQR; MPN: ISO7742DBQR; NOMINAL_SUPPLY_CURRENT: 0.9-13.4mA; PACKAGE: SSOP16; PREFIX: U; ROHS: Yes; STANDOFF_HEIGHT: 0.11mm; TEMPERATURE_RANGE_HIGH: +125°C; TEMPERATURE_RANGE_LOW: -55°C; VERIFICATION_VERSION: 0.0.0.1
X1 = Hexabitz:XTALL_CSTCE8M00G52: MURATA CSTCE8M00G52-R0 RESONATOR, SMD, 8MHZ ; Octopart Url : https://octopart.com/cstce8m00g52-r0-murata-7145559; MFN: Murata; MPN: CSTCE8M00G52Z-R0; OCTOPART_URL: https://octopart.com/cstce8m00g52z-r0-murata-17755941?r=sp&s=JDnNJnrHQhyS8Zk4ofFWXw
X2-X4 = HEXABITZ_CONNECTION_PARTS:AK500/2: CONNECTOR; MFN: TE Connectivity; MPN: 282836-2; OCTOPART_URL: https://octopart.com/282836-2-te+connectivity-39396934?r=sp